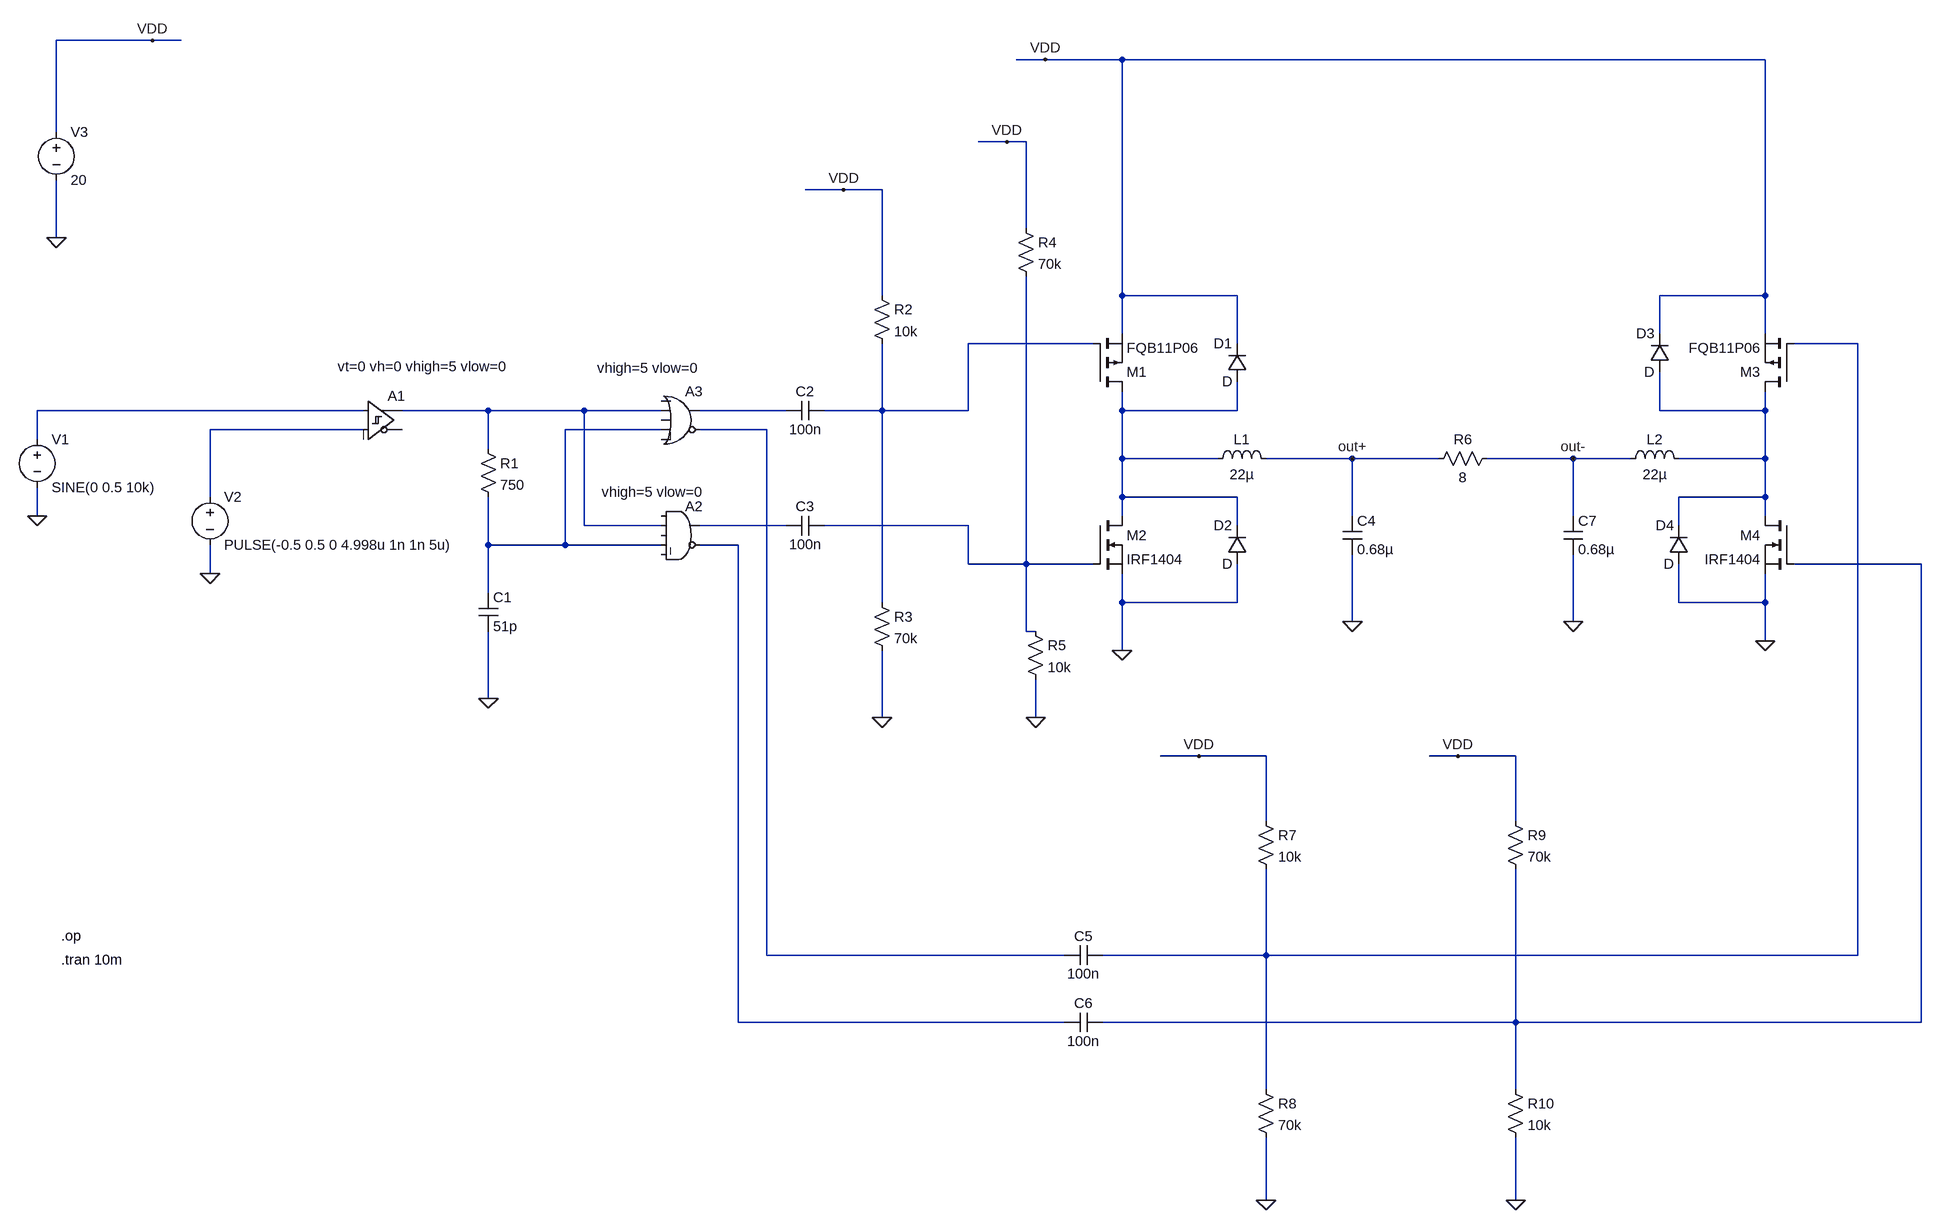
[diagram p0: schematic ClassDAmplifier.asc]
ClassDAmplifier.asc, the LTspice schematic file:
Version 4
SHEET 1 6292 2304
WIRE -336 -336 -496 -336
WIRE -288 -336 -336 -336
WIRE 1152 -304 1104 -304
WIRE 1280 -304 1152 -304
WIRE 2352 -304 1280 -304
WIRE -496 -176 -496 -336
WIRE 1088 -160 1040 -160
WIRE 1120 -160 1088 -160
WIRE 816 -80 752 -80
WIRE 880 -80 816 -80
WIRE 1120 -16 1120 -160
WIRE -496 0 -496 -96
WIRE 880 96 880 -80
WIRE 1280 96 1280 -304
WIRE 1472 96 1280 96
WIRE 2352 96 2352 -304
WIRE 2352 96 2176 96
WIRE 1280 160 1280 96
WIRE 2176 160 2176 96
WIRE 2352 160 2352 96
WIRE 1232 176 1024 176
WIRE 1472 176 1472 96
WIRE 2608 176 2400 176
WIRE 16 288 -528 288
WIRE 224 288 80 288
WIRE 384 288 224 288
WIRE 512 288 384 288
WIRE 720 288 576 288
WIRE 880 288 880 176
WIRE 880 288 784 288
WIRE 1024 288 1024 176
WIRE 1024 288 880 288
WIRE 1280 288 1280 256
WIRE 1472 288 1472 240
WIRE 1472 288 1280 288
WIRE 2176 288 2176 224
WIRE 2352 288 2352 256
WIRE 2352 288 2176 288
WIRE 16 320 -240 320
WIRE 512 320 352 320
WIRE 688 320 576 320
WIRE -528 336 -528 288
WIRE 224 352 224 288
WIRE 1280 368 1280 288
WIRE 1440 368 1280 368
WIRE 1664 368 1520 368
WIRE 1808 368 1664 368
WIRE 2032 368 1888 368
WIRE 2128 368 2032 368
WIRE 2352 368 2352 288
WIRE 2352 368 2208 368
WIRE -240 432 -240 320
WIRE 1280 432 1280 368
WIRE 1472 432 1280 432
WIRE 2352 432 2352 368
WIRE 2352 432 2208 432
WIRE -528 464 -528 416
WIRE 1280 464 1280 432
WIRE 1664 464 1664 368
WIRE 2032 464 2032 368
WIRE 2352 464 2352 432
WIRE 384 480 384 288
WIRE 512 480 384 480
WIRE 720 480 576 480
WIRE 1024 480 784 480
WIRE 1472 480 1472 432
WIRE 2208 480 2208 432
WIRE 224 512 224 432
WIRE 352 512 352 320
WIRE 352 512 224 512
WIRE 512 512 352 512
WIRE 640 512 576 512
WIRE 1024 544 1024 480
WIRE 1120 544 1120 64
WIRE 1120 544 1024 544
WIRE 1232 544 1120 544
WIRE 2720 544 2400 544
WIRE -240 560 -240 512
WIRE 224 592 224 512
WIRE 880 608 880 288
WIRE 1280 608 1280 560
WIRE 1472 608 1472 544
WIRE 1472 608 1280 608
WIRE 2208 608 2208 544
WIRE 2352 608 2352 560
WIRE 2352 608 2208 608
WIRE 1664 640 1664 528
WIRE 2032 640 2032 528
WIRE 1120 656 1120 544
WIRE 1136 656 1120 656
WIRE 2352 672 2352 608
WIRE 1280 688 1280 608
WIRE 224 768 224 656
WIRE 880 800 880 688
WIRE 1136 800 1136 736
WIRE 1408 864 1344 864
WIRE 1520 864 1408 864
WIRE 1840 864 1792 864
WIRE 1936 864 1840 864
WIRE 1520 1024 1520 864
WIRE 1936 1024 1936 864
WIRE 688 1296 688 320
WIRE 1184 1296 688 1296
WIRE 1520 1296 1520 1104
WIRE 1520 1296 1248 1296
WIRE 2608 1296 2608 176
WIRE 2608 1296 1520 1296
WIRE 640 1408 640 512
WIRE 1184 1408 640 1408
WIRE 1936 1408 1936 1104
WIRE 1936 1408 1248 1408
WIRE 2720 1408 2720 544
WIRE 2720 1408 1936 1408
WIRE 1520 1520 1520 1296
WIRE 1936 1520 1936 1408
WIRE 1520 1728 1520 1600
WIRE 1936 1728 1936 1600
FLAG -240 560 0
FLAG -528 464 0
FLAG 224 768 0
FLAG -496 0 0
FLAG -336 -336 VDD
FLAG 1280 688 0
FLAG 1152 -304 VDD
FLAG 1136 800 0
FLAG 880 800 0
FLAG 816 -80 VDD
FLAG 1088 -160 VDD
FLAG 1664 640 0
FLAG 2032 640 0
FLAG 2352 672 0
FLAG 1520 1728 0
FLAG 1936 1728 0
FLAG 1408 864 VDD
FLAG 1840 864 VDD
FLAG 1664 368 out+
FLAG 2032 368 out-
SYMBOL Digital\\diffschmitt 16 240 R0
WINDOW 3 -43 -25 Left 2
SYMATTR Value vt=0 vh=0 vhigh=5 vlow=0
SYMATTR InstName A1
SYMBOL voltage -528 320 R0
WINDOW 123 0 0 Left 0
WINDOW 39 0 0 Left 0
SYMATTR InstName V1
SYMATTR Value SINE(0 0.5 10k)
SYMBOL voltage -240 416 R0
WINDOW 123 0 0 Left 0
WINDOW 39 0 0 Left 0
SYMATTR InstName V2
SYMATTR Value PULSE(-0.5 0.5 0 4.998u 1n 1n 5u)
SYMBOL Digital\\and 544 432 R0
WINDOW 3 -131 -8 Left 2
SYMATTR Value vhigh=5 vlow=0
SYMATTR InstName A2
SYMBOL Digital\\or 544 240 R0
WINDOW 3 -139 -23 Left 2
SYMATTR Value vhigh=5 vlow=0
SYMATTR InstName A3
SYMBOL res 208 336 R0
SYMATTR InstName R1
SYMATTR Value 750
SYMBOL cap 208 592 R0
SYMATTR InstName C1
SYMATTR Value 51p
SYMBOL voltage -496 -192 R0
WINDOW 123 0 0 Left 0
WINDOW 39 0 0 Left 0
SYMATTR InstName V3
SYMATTR Value 20
SYMBOL cap 784 272 R90
WINDOW 0 0 32 VBottom 2
WINDOW 3 32 32 VTop 2
SYMATTR InstName C2
SYMATTR Value 100n
SYMBOL cap 784 464 R90
WINDOW 0 0 32 VBottom 2
WINDOW 3 32 32 VTop 2
SYMATTR InstName C3
SYMATTR Value 100n
SYMBOL pmos 1232 256 M180
SYMATTR InstName M1
SYMATTR Value FQB11P06
SYMBOL nmos 1232 464 R0
SYMATTR InstName M2
SYMATTR Value IRF1404
SYMBOL res 864 80 R0
SYMATTR InstName R2
SYMATTR Value 10k
SYMBOL res 864 592 R0
SYMATTR InstName R3
SYMATTR Value 70k
SYMBOL res 1104 -32 R0
SYMATTR InstName R4
SYMATTR Value 70k
SYMBOL res 1120 640 R0
SYMATTR InstName R5
SYMATTR Value 10k
SYMBOL ind 1424 384 R270
WINDOW 0 32 56 VTop 2
WINDOW 3 5 56 VBottom 2
SYMATTR InstName L1
SYMATTR Value 22µ
SYMBOL cap 1648 464 R0
SYMATTR InstName C4
SYMATTR Value 0.68µ
SYMBOL res 1904 352 R90
WINDOW 0 0 56 VBottom 2
WINDOW 3 32 56 VTop 2
SYMATTR InstName R6
SYMATTR Value 8
SYMBOL diode 1488 240 R180
WINDOW 0 24 64 Left 2
WINDOW 3 24 0 Left 2
SYMATTR InstName D1
SYMBOL diode 1488 544 R180
WINDOW 0 24 64 Left 2
WINDOW 3 24 0 Left 2
SYMATTR InstName D2
SYMBOL cap 1248 1280 R90
WINDOW 0 0 32 VBottom 2
WINDOW 3 32 32 VTop 2
SYMATTR InstName C5
SYMATTR Value 100n
SYMBOL cap 1248 1392 R90
WINDOW 0 0 32 VBottom 2
WINDOW 3 32 32 VTop 2
SYMATTR InstName C6
SYMATTR Value 100n
SYMBOL pmos 2400 256 R180
SYMATTR InstName M3
SYMATTR Value FQB11P06
SYMBOL cap 2016 464 R0
SYMATTR InstName C7
SYMATTR Value 0.68µ
SYMBOL ind 2112 384 R270
WINDOW 0 32 56 VTop 2
WINDOW 3 5 56 VBottom 2
SYMATTR InstName L2
SYMATTR Value 22µ
SYMBOL nmos 2400 464 M0
SYMATTR InstName M4
SYMATTR Value IRF1404
SYMBOL res 1504 1008 R0
SYMATTR InstName R7
SYMATTR Value 10k
SYMBOL res 1504 1504 R0
SYMATTR InstName R8
SYMATTR Value 70k
SYMBOL res 1920 1008 R0
SYMATTR InstName R9
SYMATTR Value 70k
SYMBOL res 1920 1504 R0
SYMATTR InstName R10
SYMATTR Value 10k
SYMBOL diode 2192 224 R180
WINDOW 0 24 64 Left 2
WINDOW 3 24 0 Left 2
SYMATTR InstName D3
SYMBOL diode 2224 544 R180
WINDOW 0 24 64 Left 2
WINDOW 3 24 0 Left 2
SYMATTR InstName D4
TEXT -488 1264 Left 2 !.op
TEXT -488 1304 Left 2 !.tran 10m

The netlist it stands for:
* ClassDAmplifier.asc
A1 N003 N008 0 0 0 0 N004 0 SCHMITT vt=0 vh=0 vhigh=5 vlow=0
V1 N003 0 SINE(0 0.5 10k)
V2 N008 0 PULSE(-0.5 0.5 0 4.998u 1n 1n 5u)
A2 0 N004 0 N009 0 N013 N011 0 AND vhigh=5 vlow=0
A3 0 N004 0 N009 0 N010 N005 0 OR vhigh=5 vlow=0
R1 N004 N009 750
C1 N009 0 51p
V3 VDD 0 20
C2 N001 N005 100n
C3 N012 N011 100n
M1 N006 N001 VDD VDD FQB11P06
M2 N006 N012 0 0 IRF1404
R2 VDD N001 10k
R3 N001 0 70k
R4 VDD N012 70k
R5 N012 0 10k
L1 N006 out+ 22µ
C4 out+ 0 0.68µ
R6 out- out+ 8
D1 N006 VDD D
D2 0 N006 D
C5 N002 N010 100n
C6 N014 N013 100n
M3 N007 N002 VDD VDD FQB11P06
C7 out- 0 0.68µ
L2 out- N007 22µ
M4 N007 N014 0 0 IRF1404
R7 VDD N002 10k
R8 N002 0 70k
R9 VDD N014 70k
R10 N014 0 10k
D3 N007 VDD D
D4 0 N007 D
.model D D
.lib standard.dio
.model NMOS NMOS
.model PMOS PMOS
.lib standard.mos
.op
.tran 10m
.backanno
.end